# EAGLE design harp expander magnetic encoder v1.0 (EAGLE 9.5.1)
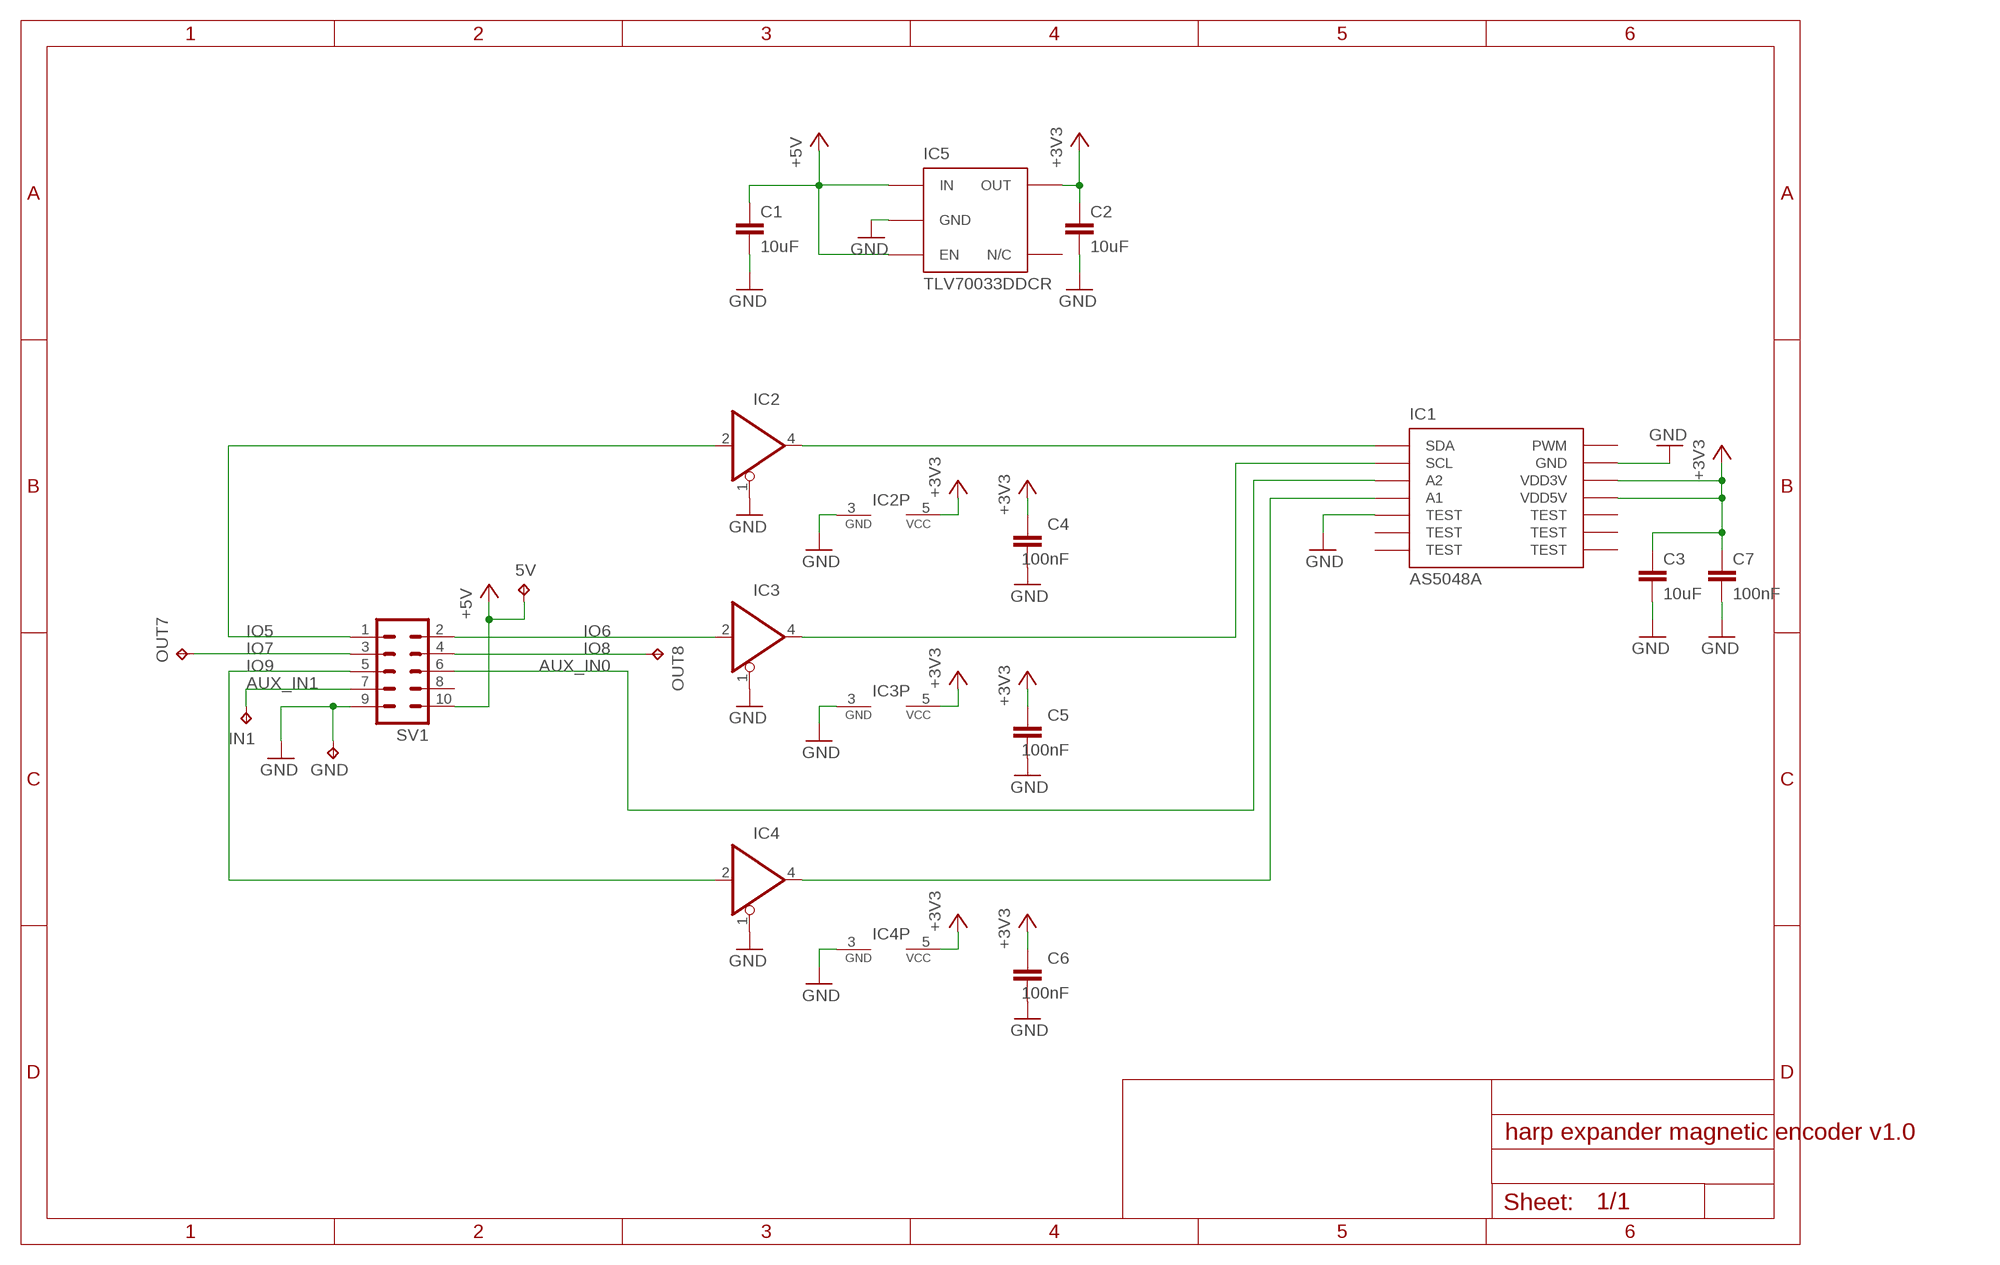
[diagram p0: schematic, sheet 1]

## Parts
5V  TPPAD1-13  [P1-13]
C1  10uF  C-EUC0603  [C0603]
C2  10uF  C-EUC0603  [C0603]
C3  10uF  C-EUC0603  [C0603]
C4  100nF  C-EUC0402  [C0402]
C5  100nF  C-EUC0402  [C0402]
C6  100nF  C-EUC0402  [C0402]
C7  100nF  C-EUC0402  [C0402]
GND  TPPAD1-13  [P1-13]
IC1  AS5048A  AS5048B  [TSSOP-14]
IC2  SN74LVC1G125DBVT  74AHC1G125DBV  [SOT23-5]
IC3  SN74LVC1G125DBVT  74AHC1G125DBV  [SOT23-5]
IC4  SN74LVC1G125DBVT  74AHC1G125DBV  [SOT23-5]
IC5  TLV70033DDCR  TLV700XX  [TSOT23-5]
IN1  TPPAD1-13  [P1-13]
OUT7  TPPAD1-13  [P1-13]
OUT8  TPPAD1-13  [P1-13]
SV1  ML10  [ML10]

## Nets
!CS: IC1.1(SDA) IC2.4(O)
+3V3: C2.1 C3.1 C4.1 C5.1 C6.1 C7.1 IC1.11(VDD5V) IC1.12(VDD3V) IC2.5(VCC) IC3.5(VCC) IC4.5(VCC) IC5.5(OUT)
+5V: 5V.TP C1.1 IC5.1(IN) IC5.3(EN) SV1.10
AUX_IN0: IC1.3(A2) SV1.6
AUX_IN1: IN1.TP SV1.7
CLK: IC1.2(SCL) IC3.4(O)
GND: C1.2 C2.2 C3.2 C4.2 C5.2 C6.2 C7.2 GND.TP IC1.5(TEST) IC1.13(GND) IC2.1(OE) IC2.3(GND) IC3.1(OE) IC3.3(GND) IC4.1(OE) IC4.3(GND) IC5.2(GND) SV1.9
IO5: IC2.2(I) SV1.1
IO6: IC3.2(I) SV1.2
IO7: OUT7.TP SV1.3
IO8: OUT8.TP SV1.4
IO9: IC4.2(I) SV1.5
MOSI: IC1.4(A1) IC4.4(O)
Unconnected: IC1.6(TEST) IC1.7(TEST) IC1.8(TEST) IC1.9(TEST) IC1.10(TEST) IC1.14(PWM) IC5.4(N/C) SV1.8

## Library data of the parts
5V GND IN1 OUT7 OUT8 = testpad:TP: Test pad
C1-C3 = rcl:C-EU: CAPACITOR, European symbol; MPN: C1608X6S1C475K080AC
C4-C7 = rcl:C-EU: CAPACITOR, European symbol; MPN: MC0402B104K160CT
IC1 = CNP-sensors:AS5048B
IC2-IC4 = 74xx-little-de:74*1G125: Single Bus Buffer Gate with 3-State Output; MPN: SN74LVC1G125DBVT
IC5 = CNP:TLV700XX; MPN: TLV70033DDCR
SV1 = con-ml:ML10: HARTING; OC_FARNELL: unknown; OC_NEWARK: unknown

## Net classes
1 power: width 0.381 mm

## Board
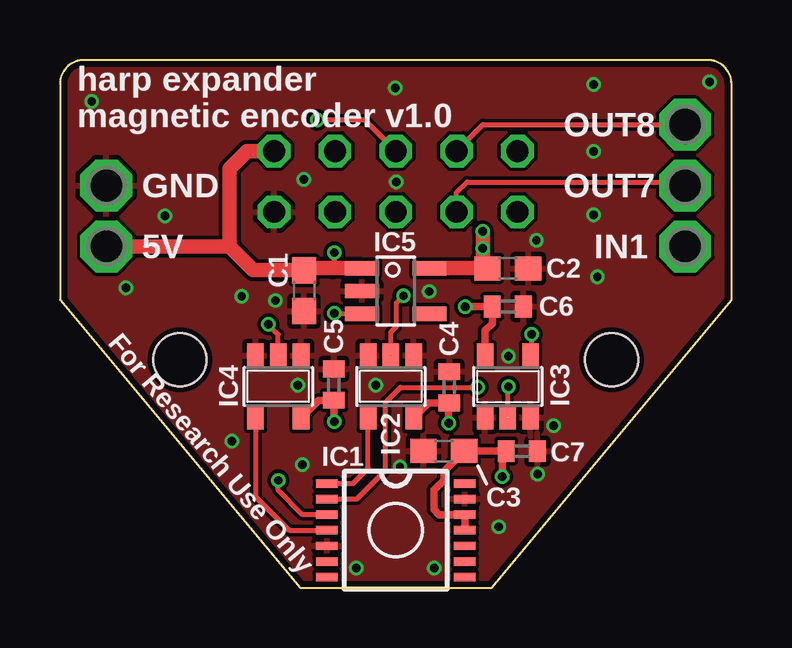
[diagram p1: board, top side]
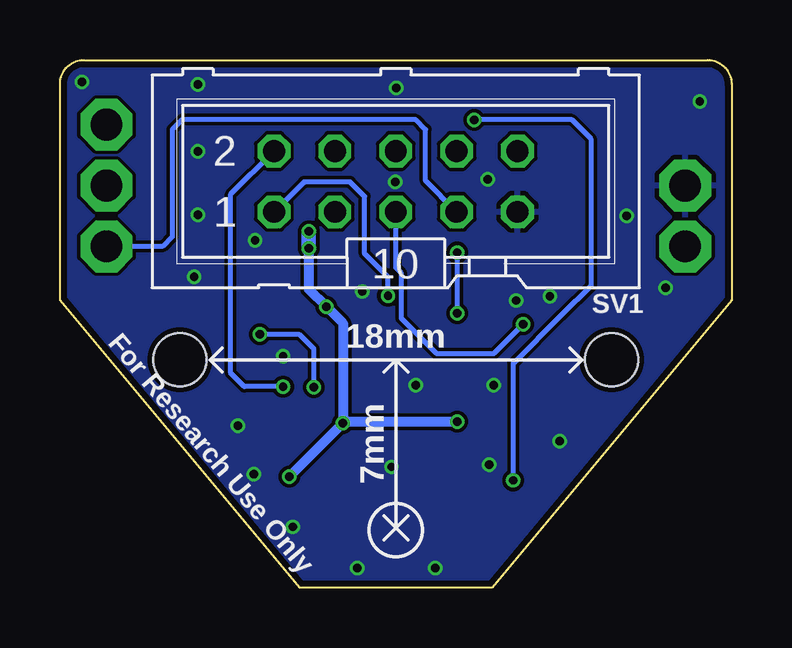
[diagram p2: board, bottom side, seen from below]

Size 28 x 22 mm. Coordinates in mm from the lower left corner, seen from the top.
Outline: 0,21 0,12 10,0 18,0 28,12 28,21 arc90 27,22 1,22 arc90 0,21
Copper layers (1*16): Top 0.018mm / dielectric 1.55mm / Bottom 0.018mm
Design rules "eC_2Layer_PClass6_BaseCopperO18_eCDefault *": minimum track width 0.15mm, minimum drill 0.35mm, track to track 0.15mm, track to pad 0.15mm, pad to pad 0.15mm, via to via 0.15mm, smd to smd 0mil, copper to edge 0.25mm, drill to drill 0.35mm, minimum pad ring 0.175mm, minimum via ring 0.125mm, stop-mask expansion 0mil, vias tented up to drill 0.45mm, thermal gap 0.2mm
Holes 2.2 mm at 5,9.5 23,9.5

### Footprints (pad centres in the part's own frame; a part is rotated, then mirrored left to right if it is on the bottom)
P1-13 = drill 1.321 pad 2.159 octagon: TP 0,0
C0603 = smd 1.1 x 1: 1 -0.85,0; 2 0.85,0
C0402 = smd 0.7 x 0.9: 1 -0.65,0; 2 0.65,0
TSSOP-14 = smd 0.9 x 0.35: 1 -2.875,1.95; 2 -2.875,1.3; 3 -2.875,0.65; 4 -2.875,0; 5 -2.875,-0.65; 6 -2.875,-1.3; 7 -2.875,-1.95; 8 2.875,-1.95; 9 2.875,-1.3; 10 2.875,-0.65; 11 2.875,0; 12 2.875,0.65; 13 2.875,1.3; 14 2.875,1.95
SOT23-5 = smd 0.69 x 0.99: 1 -0.95,-1.29; 2 0,-1.29; 3 0.95,-1.29; 4 0.95,1.3; 5 -0.95,1.3
TSOT23-5 = smd 0.6 x 1.408: 1 -0.95,-1.404; 2 0,-1.404; 3 0.95,-1.404; 4 0.95,1.404; 5 -0.95,1.404
ML10 = drill 0.914 octagon: 1 -5.08,-1.27; 2 -5.08,1.27; 3 -2.54,-1.27; 4 -2.54,1.27; 5 0,-1.27; 6 0,1.27; 7 2.54,-1.27; 8 2.54,1.27; 9 5.08,-1.27; 10 5.08,1.27

### Placement (x,y rotation side)
5V  1.93,14.22 90 top
C1  10.18,12.38 270 top
C2  18.67,13.3 0 top
C3  16,5.69 180 top
C4  16.23,8.35 90 top
C5  11.42,8.46 90 top
C6  18.67,11.72 0 top
C7  19.26,5.69 0 top
GND  1.93,16.76 90 top
IC1  14,2.39 0 top
IC2  13.8,8.38 180 top
IC3  18.67,8.38 0 top
IC4  9.1,8.38 180 top
IC5  14,12.36 270 top
IN1  26.06,14.22 90 top
OUT7  26.06,16.76 90 top
OUT8  26.06,19.3 90 top
SV1  14,16.94 0 bottom

### Tracks (layer width: path | path; a pad name or v marks a point on that pad's centre or on a via)
!CS
  Top 0.203: IC1.1 12.21,4.34 12.85,4.97 IC2.4
+3V3  (via drill 0.35)
  Top 0.305: v11.43,6.91 11.42,6.92 C5.1 10.78,7.81 IC4.5 | IC2.5 15.37,7.7 C4.1 16.21,7.68 v16.21,6.86 | v18.44,4.62 18.44,5.53 C7.1 C3.1 16.01,4.84 16.01,4.47 15.6,4.06 15.6,3.25 15.81,3.04 IC1.12 IC1.11 | v16.89,11.71 18.02,11.71 C6.1 18.02,11.01 17.72,10.71 IC3.5
  Top 0.61: IC5.5 17.81,13.31 C2.1 17.63,13.5 v17.63,14.14 v17.63,14.85
  Bottom 0.305: 16.16,6.91 v16.21,6.86
  Bottom 0.406: v17.63,14.14 17.63,12.45 v16.89,11.71 16.21,11.02 v16.21,6.86 v18.44,4.62 | v11.43,6.91 16.16,6.91
  Bottom 0.61: v17.63,14.85 v17.63,14.14
+5V  (via drill 0.35)
  Top 0.203: IC5.3 11.45,11.41 v11.43,11.43 | v11.43,13.97 11.43,13.36 11.38,13.31
  Top 0.61: SV1.10 7.79,18.21 7.06,17.48 7.06,14.22 | 7.06,14.22 8.06,13.23 C1.1 10.26,13.31 11.38,13.31 IC5.1 | 5V.TP 7.06,14.22
  Bottom 0.203: v11.43,11.43 v11.43,13.97
AUX_IN0  (via drill 0.35)
  Top 0.203: IC1.3 10.12,3.04 9.1,4.06 v9.1,4.47 | v10.72,19.51 12.7,19.51 SV1.6
  Bottom 0.203: v9.1,4.47 9.1,9.35 7.06,11.38 5.85,12.6 5.85,18.69 6.66,19.51 v10.72,19.51
AUX_IN1
  Bottom 0.203: SV1.7 12.75,16.96 12.75,19.1 13.16,19.51 22.91,19.51 23.32,19.1 23.32,14.63 23.73,14.22 IN1.TP
CLK  (via drill 0.35)
  Top 0.203: IC1.2 12.38,3.69 13.57,4.88 13.57,7.72 14.19,8.35 v17.41,8.35 | v19.66,10.57 19.66,9.72 IC3.4
  Bottom 0.203: v17.41,8.35 17.41,9.94 18.04,10.57 v19.66,10.57
GND  (via drill 0.35)
  other vias: 18.29,2.53 12.35,0.81 15.6,0.81 8.97,11.97 10.11,5.13 14.18,5.03 19.92,4.72 20.58,6.76 18.7,9.65 13.16,8.43 9.91,8.43 7.17,6.1 7.57,12.14 2.75,12.5 4.37,15.49 10.16,17.02 14.02,16.92 15.4,12.34 19.87,14.48 22.41,12.95 22.25,15.54 22.25,18.19 22.25,20.98 27.08,21.08 1.32,20.27 13.97,20.83
  pour Top: 0,22 0,0 28,0 28,22
  pour Bottom: 0,22 0,0 28,0 28,22
IO5  (via drill 0.35)
  Top 0.203: v14.32,12.17 14.02,11.87 14.02,10.88 13.8,10.65 IC2.2
  Bottom 0.203: v14.32,12.17 14.32,12.95 15.29,13.92 15.29,16.31 15.9,16.92 17.83,16.92 SV1.1
IO6  (via drill 0.35)
  Top 0.203: IC3.2 18.67,8.36 v18.7,8.38
  Bottom 0.203: v18.7,8.38 20.32,8.38 20.88,8.94 20.88,16.4 SV1.2
IO7
  Top 0.203: SV1.3 16.54,16.49 16.97,16.92 25.91,16.92 OUT7.TP
IO8
  Top 0.203: SV1.4 17.64,19.3 OUT8.TP
IO9  (via drill 0.35)
  Top 0.203: IC4.2 9.1,10.56 v8.69,10.97
  Bottom 0.203: v8.69,10.97 9.91,9.75 12.3,9.75 13.77,11.23 13.77,13.11 14,13.34 SV1.5
MOSI
  Top 0.203: IC4.4 8.15,3.79 9.55,2.39 IC1.4

### Text on the board
tPlace: harp expander / magnetic encoder v1.0 | For Research Use Only
bPlace: 18mm | 7mm | For Research Use Only